# Altium schematic sheet UKU208_cpu.SchDoc
size A3
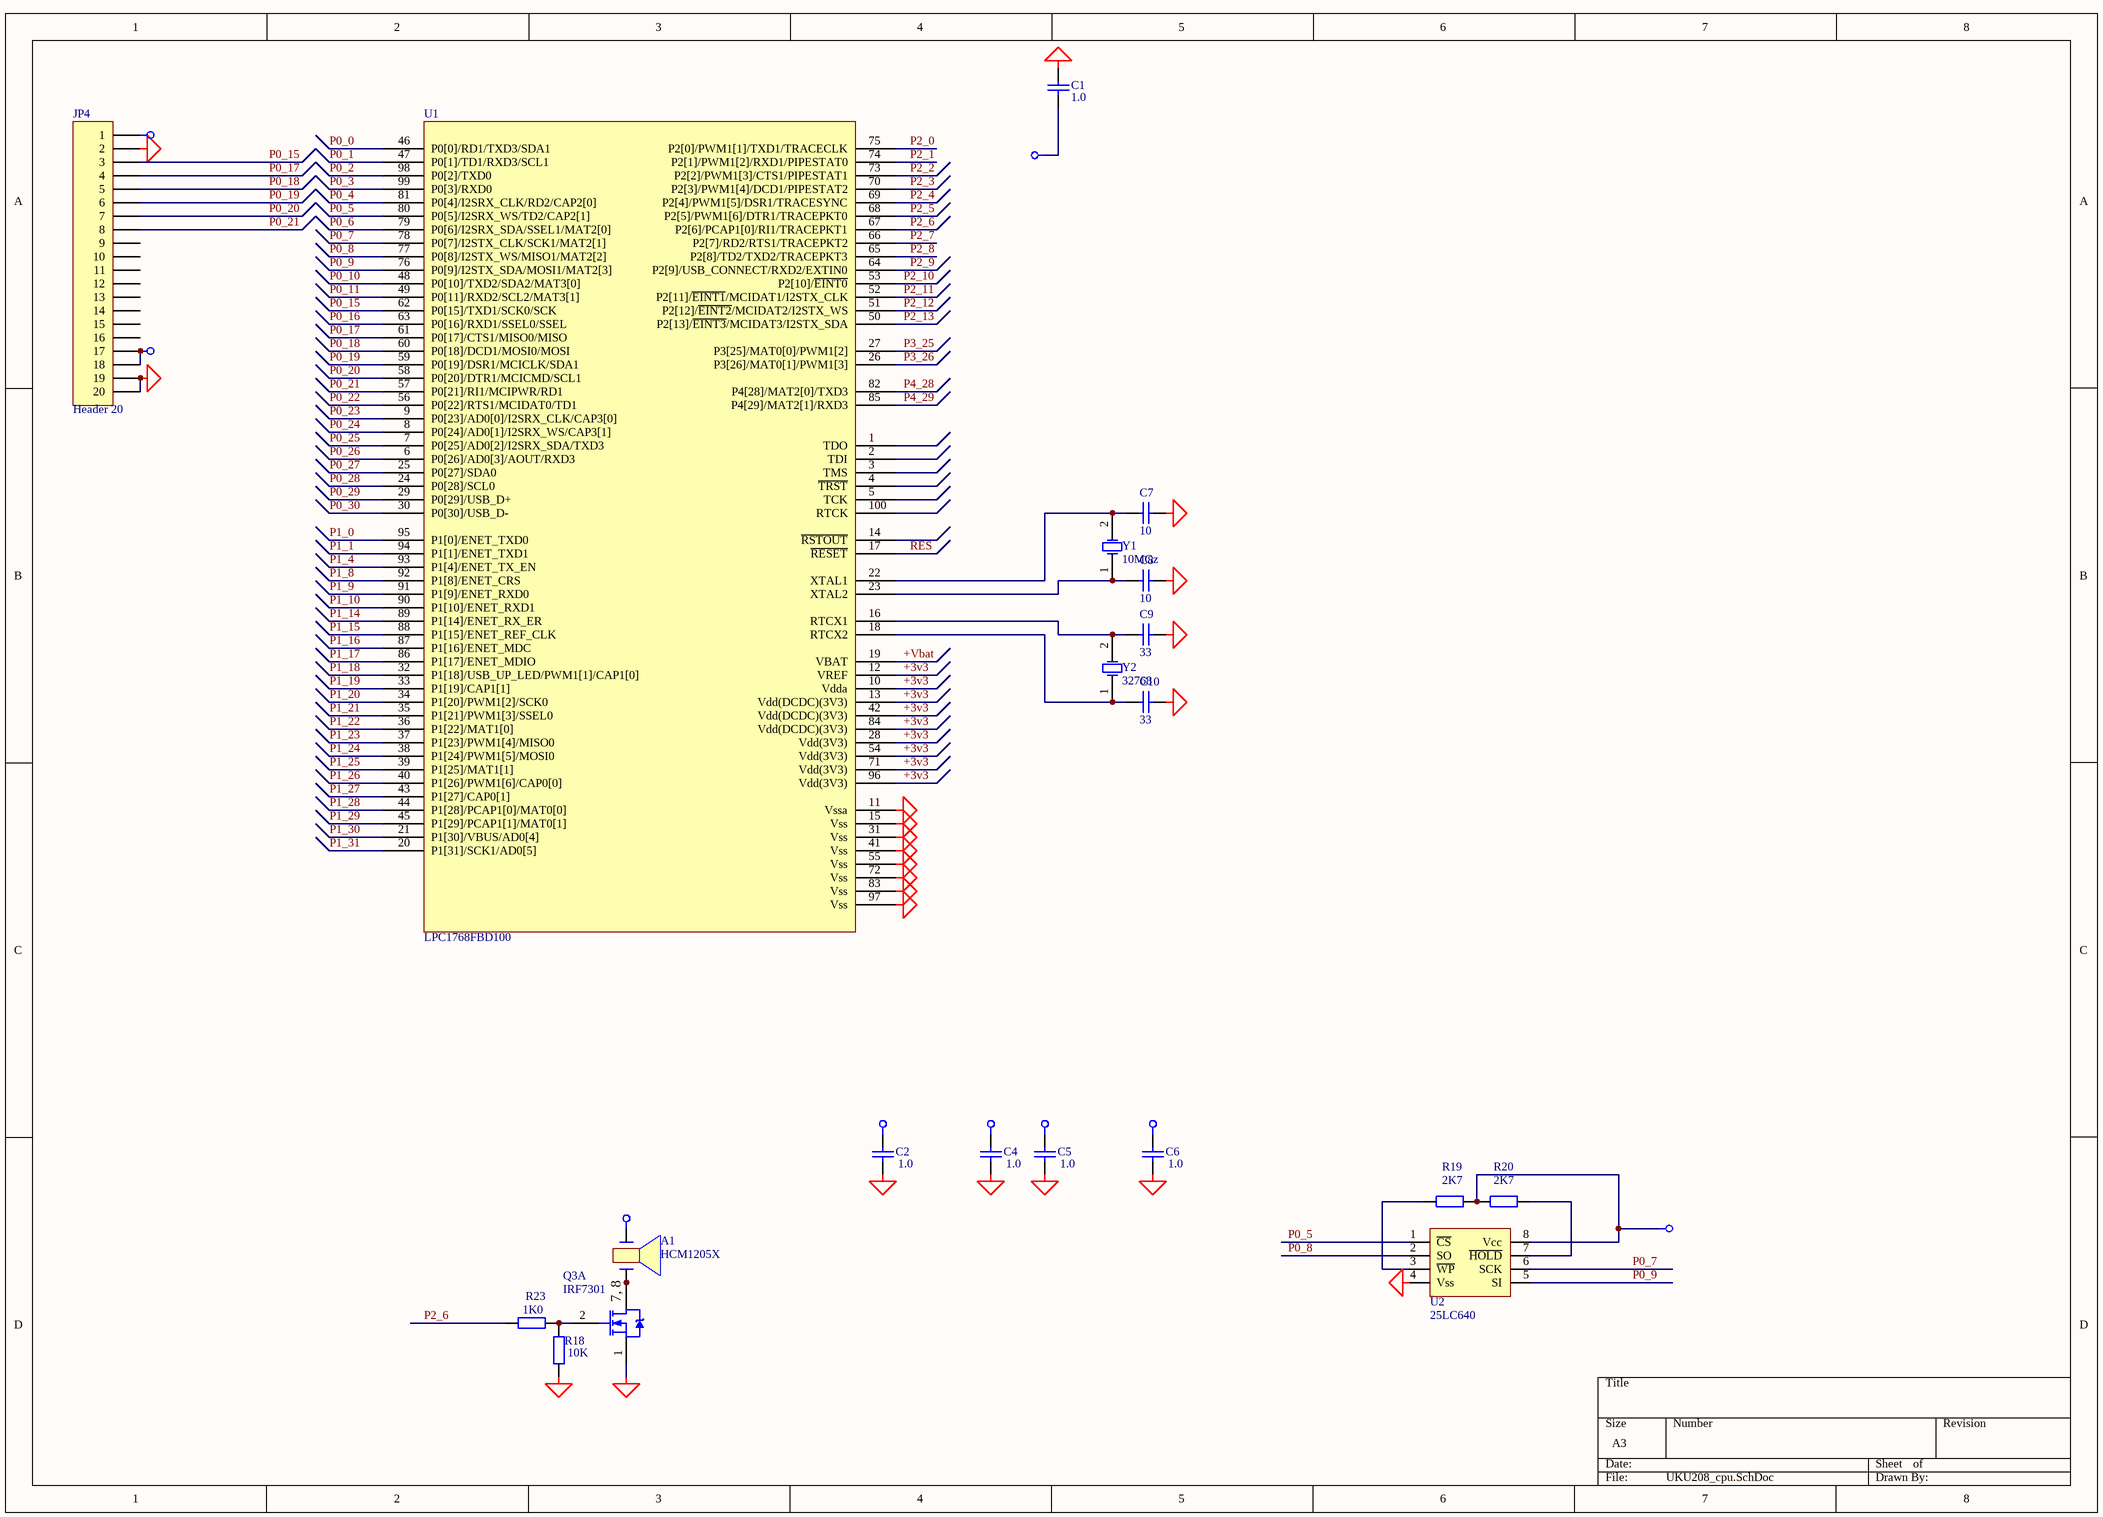
[diagram p0: UKU208_cpu.SchDoc]

## Parts
A1  HCM1205X  [zumm]
C1  1.0  [_1206]
C2  1.0  [_1206]
C4  1.0  [_1206]
C5  1.0  [_1206]
C6  1.0  [_1206]
C7  10  [_1206]
C8  10  [_1206]
C9  33  [_1206]
C10  33  [_1206]
JP4  Header 20  [XF2M20151A]
Q3  IRF7301  [SO-G8/Y2.2]  (part A of 2)
R18  10K  [_1206]
R19  2K7  [_1206]
R20  2K7  [_1206]
R23  1K0  [_1206]
U1  LPC1768FBD100  [LPC2368]
U2  25LC640  [SO-G8/D5]
Y1  10MGz  [QWARZ1]
Y2  32768  [QWARZ2]

## Nets
+3v3: C1.1 C5.2 JP4.1 U1.10(Vdda) U1.12(VREF) U1.13(Vdd(DCDC)(3V3)) U1.28(Vdd(3V3)) U1.42(Vdd(DCDC)(3V3)) U1.54(Vdd(3V3)) U1.71(Vdd(3V3)) U1.84(Vdd(DCDC)(3V3)) U1.96(Vdd(3V3))
+5v: A1.1 C2.2 C4.2 C6.2 JP4.17 JP4.18 R19.2 R20.1 U2.8(Vcc)
GND: C1.2 C2.1 C4.1 C5.1 C6.1 C7.1 C8.1 C9.1 C10.1 JP4.2 JP4.19 JP4.20 Q3.1(S) R18.1 U1.11(Vssa) U1.15(Vss) U1.31(Vss) U1.41(Vss) U1.55(Vss) U1.72(Vss) U1.83(Vss) U1.97(Vss) U2.4(Vss)
+Vbat: U1.19(VBAT)
P0_0: U1.46(P0[0]/RD1/TXD3/SDA1)
P0_1: U1.47(P0[1]/TD1/RXD3/SCL1)
P0_2: U1.98(P0[2]/TXD0)
P0_3: U1.99(P0[3]/RXD0)
P0_4: U1.81(P0[4]/I2SRX_CLK/RD2/CAP2[0])
P0_5: U1.80(P0[5]/I2SRX_WS/TD2/CAP2[1]) U2.1(~{CS})
P0_6: U1.79(P0[6]/I2SRX_SDA/SSEL1/MAT2[0])
P0_7: U1.78(P0[7]/I2STX_CLK/SCK1/MAT2[1]) U2.6(SCK)
P0_8: U1.77(P0[8]/I2STX_WS/MISO1/MAT2[2]) U2.2(SO)
P0_9: U1.76(P0[9]/I2STX_SDA/MOSI1/MAT2[3]) U2.5(SI)
P0_10: U1.48(P0[10]/TXD2/SDA2/MAT3[0])
P0_11: U1.49(P0[11]/RXD2/SCL2/MAT3[1])
P0_15: JP4.3 U1.62(P0[15]/TXD1/SCK0/SCK)
P0_16: U1.63(P0[16]/RXD1/SSEL0/SSEL)
P0_17: JP4.4 U1.61(P0[17]/CTS1/MISO0/MISO)
P0_18: JP4.5 U1.60(P0[18]/DCD1/MOSI0/MOSI)
P0_19: JP4.6 U1.59(P0[19]/DSR1/MCICLK/SDA1)
P0_20: JP4.7 U1.58(P0[20]/DTR1/MCICMD/SCL1)
P0_21: JP4.8 U1.57(P0[21]/RI1/MCIPWR/RD1)
P0_22: U1.56(P0[22]/RTS1/MCIDAT0/TD1)
P0_23: U1.9(P0[23]/AD0[0]/I2SRX_CLK/CAP3[0])
P0_24: U1.8(P0[24]/AD0[1]/I2SRX_WS/CAP3[1])
P0_25: U1.7(P0[25]/AD0[2]/I2SRX_SDA/TXD3)
P0_26: U1.6(P0[26]/AD0[3]/AOUT/RXD3)
P0_27: U1.25(P0[27]/SDA0)
P0_28: U1.24(P0[28]/SCL0)
P0_29: U1.29(P0[29]/USB_D+)
P0_30: U1.30(P0[30]/USB_D-)
P1_0: U1.95(P1[0]/ENET_TXD0)
P1_1: U1.94(P1[1]/ENET_TXD1)
P1_4: U1.93(P1[4]/ENET_TX_EN)
P1_8: U1.92(P1[8]/ENET_CRS)
P1_9: U1.91(P1[9]/ENET_RXD0)
P1_10: U1.90(P1[10]/ENET_RXD1)
P1_14: U1.89(P1[14]/ENET_RX_ER)
P1_15: U1.88(P1[15]/ENET_REF_CLK)
P1_16: U1.87(P1[16]/ENET_MDC)
P1_17: U1.86(P1[17]/ENET_MDIO)
P1_18: U1.32(P1[18]/USB_UP_LED/PWM1[1]/CAP1[0])
P1_19: U1.33(P1[19]/CAP1[1])
P1_20: U1.34(P1[20]/PWM1[2]/SCK0)
P1_21: U1.35(P1[21]/PWM1[3]/SSEL0)
P1_22: U1.36(P1[22]/MAT1[0])
P1_23: U1.37(P1[23]/PWM1[4]/MISO0)
P1_24: U1.38(P1[24]/PWM1[5]/MOSI0)
P1_25: U1.39(P1[25]/MAT1[1])
P1_26: U1.40(P1[26]/PWM1[6]/CAP0[0])
P1_27: U1.43(P1[27]/CAP0[1])
P1_28: U1.44(P1[28]/PCAP1[0]/MAT0[0])
P1_29: U1.45(P1[29]/PCAP1[1]/MAT0[1])
P1_30: U1.21(P1[30]/VBUS/AD0[4])
P1_31: U1.20(P1[31]/SCK1/AD0[5])
P2_0: U1.75(P2[0]/PWM1[1]/TXD1/TRACECLK)
P2_1: U1.74(P2[1]/PWM1[2]/RXD1/PIPESTAT0)
P2_2: U1.73(P2[2]/PWM1[3]/CTS1/PIPESTAT1)
P2_3: U1.70(P2[3]/PWM1[4]/DCD1/PIPESTAT2)
P2_4: U1.69(P2[4]/PWM1[5]/DSR1/TRACESYNC)
P2_5: U1.68(P2[5]/PWM1[6]/DTR1/TRACEPKT0)
P2_6: R23.1 U1.67(P2[6]/PCAP1[0]/RI1/TRACEPKT1)
P2_7: U1.66(P2[7]/RD2/RTS1/TRACEPKT2)
P2_8: U1.65(P2[8]/TD2/TXD2/TRACEPKT3)
P2_9: U1.64(P2[9]/USB_CONNECT/RXD2/EXTIN0)
P2_10: U1.53(P2[10]/~{EINT0})
P2_11: U1.52(P2[11]/~{EINT1}/MCIDAT1/I2STX_CLK)
P2_12: U1.51(P2[12]/~{EINT2}/MCIDAT2/I2STX_WS)
P2_13: U1.50(P2[13]/~{EINT3}/MCIDAT3/I2STX_SDA)
P3_25: U1.27(P3[25]/MAT0[0]/PWM1[2])
P3_26: U1.26(P3[26]/MAT0[1]/PWM1[3])
P4_28: U1.82(P4[28]/MAT2[0]/TXD3)
P4_29: U1.85(P4[29]/MAT2[1]/RXD3)
RES: U1.17(~{RESET})
NetA1_2: A1.2 Q3.7(D) Q3.8(D)
NetC7_2: C7.2 U1.22(XTAL1) Y1.2(OSC2)
NetC8_2: C8.2 U1.23(XTAL2) Y1.1(OSC1)
NetC9_2: C9.2 U1.16(RTCX1) Y2.2(OSC2)
NetC10_2: C10.2 U1.18(RTCX2) Y2.1(OSC1)
NetQ3_2: Q3.2(G) R18.2 R23.2
NetR19_1: R19.1 U2.3(~{WP})
NetR20_2: R20.2 U2.7(~{HOLD})

Not connected (* = marked no-connect by the designer): JP4 9 10 11 12 13 14 15 16; U1 1(TDO) 2(TDI) 3(TMS) 4(~{TRST}) 5(TCK) 14(~{RSTOUT}) 100(RTCK)

## Notes on the sheet
- (in symbol IRF7301, part A) 7, 8

## Library data of the parts
A1 = PJEZ0: Beeper; Value: EFM260
C1 = Cap Semi: Capacitor; Manufacturer: Generic Components; Class I: Passive; Value: 1,0; Published: 8-Jun-2000; Revision: July-2002: Re-released for DXP Platform.; Publisher: Altium Limited; Class II: Capacitor
C2 C4-C6 = Cap Semi: Capacitor; Manufacturer: Generic Components; Class I: Passive; Value: 0,1; Published: 8-Jun-2000; Revision: July-2002: Re-released for DXP Platform.; Publisher: Altium Limited; Class II: Capacitor
C7 C8 = Cap Semi: Capacitor; Manufacturer: Generic Components; Class I: Passive; Value: 15pF; Published: 8-Jun-2000; Revision: July-2002: Re-released for DXP Platform.; Publisher: Altium Limited; Class II: Capacitor
C9 C10 = Cap Semi: Capacitor (Semiconductor SIM Model); Manufacturer: Generic Components; Class I: Passive; Value: 15pF; Published: 8-Jun-2000; Revision: July-2002: Re-released for DXP Platform.; Publisher: Altium Limited; Class II: Capacitor
JP4 = Header 20: Header, 20-Pin; Manufacturer: Generic Components; Class I: Connector; Revision: July-2002: Re-released for DXP Platform.; Publisher: Altium Limited
Q3 = IRF7301: FET; Manufacturer: International Rectifier; Revision 1: 29-Sep-2000: Re-orientated a 'Drain' pin on first part.; Revision 2: July-2002: Re-released for DXP Platform.; Class I: Discrete; Class II: MOSFET - Power; Value: IRF7103; Published: 8-Jun-2000; Datasheet: Latest Revision: Aug-1997; Package Reference: SOIC8; Publisher: Altium Limited
R18 = Res2: Resistor; Manufacturer: Generic Components; Class I: Passive; Published: 8-Jun-2000; Revision: July-2002: Re-released for DXP Platform.; Publisher: Altium Limited; Class II: Resistor; Value: 10K
R19 R20 R23 = Res2: Resistor; Manufacturer: Generic Components; Class I: Passive; Rule: Undefined; Published: 8-Jun-2000; Revision: July-2002: Re-released for DXP Platform.; Publisher: Altium Limited; Class II: Resistor
  R19 R20: Value: 2K7
  R23: Value: 1K0
U1 = LPC2368FBD100
U2 = 25LC640: Memory; Value: 26LC640
Y1 Y2 = XTAL: Crystal Oscillator; Manufacturer: Generic Components; Published: 8-Jun-2000; Revision: July-2002: Re-released for DXP Platform.; Publisher: Altium Limited; Class I: Oscillator; Class II: Crystal Oscillator
  Y1: Value: 10MGz